# Altium schematic sheet Programming.SchDoc
size A; SheetNumber: 4; SheetTotal: 5
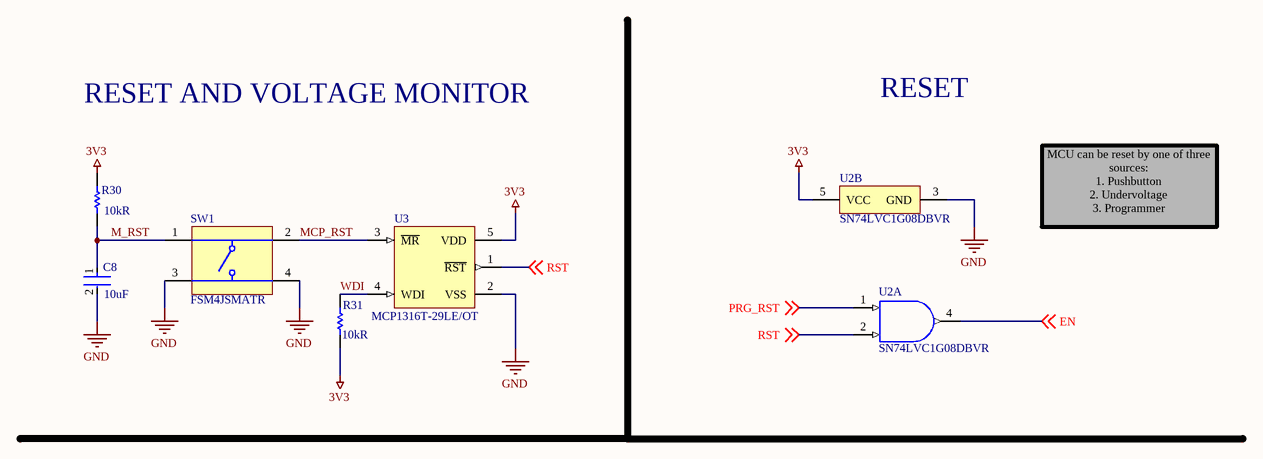
[diagram p0: Programming.SchDoc]

## Parts
C8  value 10uF  [FP-C0805C-DG-MFG]  (hidden comment: C0805C106K8PACTU)
R30  value 10kR  [RESC2013X60X35NL10T20]  (hidden comment: RC0805FR-0710KL)
R31  value 10kR  [RESC2013X60X35NL10T20]  (hidden comment: RC0805FR-0710KL)
SW1  FSM4JSMATR  [TECO-FSM4JSMATR_V]
U2  SN74LVC1G08DBVR  [DBV0005A_M]  (parts A,B of 2)
U3  MCP1316T-29LE/OT  [SOT-23-OT5_M]

## Nets
3V3: R30.2 R31.1 U2.5(VCC) U3.5(VDD)
GND: C8.2 SW1.3 SW1.4 U2.3(GND) U3.2(VSS)
EN: U2.4(Y) ; off-sheet EN
M_RST: C8.1 R30.1 SW1.1
MCP_RST: SW1.2 U3.3(~{MR})
PRG_RST: U2.1(A) ; off-sheet PRG_RST
RST: U2.2(B) U3.1(~{RST}) ; off-sheet RST
WDI: R31.2 U3.4(WDI)

## Notes on the sheet
- RESET AND VOLTAGE MONITOR
- RESET
- MCU can be reset by one of three sources:
  1. Pushbutton
  2. Undervoltage
  3. Programmer

## Library data of the parts
C8 = CMP-2007-03243-2: CAP CER 10UF 10V X5R 0805; Manufacturer: Kemet; 3DS Part Number: 220-00001; Tolerance: 10%; Temperature Coefficient: 15%; Material: Ceramic; Multilayer: Yes; Device Class L2: Capacitors; Device Class L1: Passive Components; ComponentLink2URL: https://content.kemet.com/datasheets/KEM_C1006_X5R_SMD.pdf; Height: 1.4mm; Lead Free: Yes; Manufacturer Part Number: C0805C106K8PACTU; Digikey Description: CAP CER 10UF 10V X5R 0805; Octopart: https://octopart.com/c0805c106k8pactu-kemet-98697; Capacitance: 10uF; Temperature Range Low: -55°C; Temperature: -55°C to +85°C; Automotive: No; Mouser Description: CAP CER 10UF 10V X5R 0805; Ipc Land Pattern Name: CAPC200125X125; Temperature Range High: +85°C; Voltage: 10V; RoHS: TRUE; Device Class L3: Ceramic Capacitors; ComponentLink2Description: Datasheet; Voltage Rating: 10V; Package: C0805C-DG; Temperature Characteristic: X5R; Category: Cap; Supplier: Digikey; Supplier Part Number: 399-C0805C106K8PAC7800DKR-ND; Stock: 5628606; Pricing: 1=0.14, 10=0.098, 50=0.0584, 100=0.0459, 500=0.03388, 1000=0.02805 (USD); Mounting Technology: Surface Mount; Pins: 2; Dielectric Material: Ceramic; Package Shape: Rectangular; Case/Package: 0805; Terminal Finish: Nickel; Min Operating Temperature: -55°C; Max Operating Temperature: 85°C; JESD-609 Code: e3; Capacitor Type: Ceramic; Tolerance  (fill in as +-): 10%; Package Style: SMTMeter; Packaging: Tape and Reel; Tolerance (fill in as +-): 10%; Rated DC Voltage (URdc): 10V; Termination: Wraparound; Temperature Characteristics Code: X5R; Length: 2mm; Width: 1.25mm; Reach SVHC Compliant: Yes; RoHS Compliant: Yes; ComponentLink1URL: https://datasheet.ciiva.com:443/pdfs/VipMasterIC/IC/KEME/KEME-S-A0008991665/KEME-S-A0008991665-1.pdf?src-supplier=IHS+Markit; ComponentLink1Description: https://datasheet.ciiva.com:443/pdfs/VipMasterIC/IC/KEME/KEME-S-A0008991665/KEME-S-A0008991665-1.pdf?src-supplier=IHS+Markit
R30 R31 = CMP-1659-00013-4: Chip Resistor, 10 KOhm, +/- 1%, 0.125 W, -55 to 155 degC, 0805 (2012 Metric), RoHS, Tape and Reel; Manufacturer: Yageo; Voltage Rating: 150 V; Power: 125mW; Rated Temperature: 70°C; Temperature Coefficient: 100ppm/°C; Additional Feature: LASER TRIMMABLE; Working Voltage: 150V; Package Length: 2mm; Package Height: 0.5mm; Package Width: 1.25mm; Mount: Surface Mount; ComponentLink1Description: Manufacturer URL; ComponentLink2URL: http://www.yageo.com/documents/recent/PYu-RC_Group_51_RoHS_L_04.pdf; Pins: 2; Length: 2 mm; Min Operating Temperature: -55 degC; Height: 0.5 mm; Mounting Technology: Surface Mount; RoHSCompliant: true; REACH SVHC: No SVHC; ComponentLink1URL: http://www.yageo.com/; Max Operating Temperature: 155 degC; PackageReference: 0805; DatasheetVersion: Rev. 4, 02/2016; Package Quantity: 5000; Packaging: Tape and Reel; ComponentLink2Description: Datasheet; PackageDescription: 2-Pin Surface Mounted Device, Body 2 x 1.25 mm; Supplier: Digikey; Supplier Part Number: 311-10.0KCRCT-ND; Manufacturer Part Number: RC0805FR-0710KL; RoHS: Yes; Category: Chip SMD Resistors; Stock: 4430741; Pricing: 1=0.1, 10=0.027, 50=0.017, 100=0.0142, 500=0.00976, 1000=0.00844 (USD); Package Shape: Rectangular; Terminal Finish: Nickel; Case/Package: 0805; Tolerance: 1%; JESD-609 Code: e3; Resistor Type: FIXED RESISTOR; Construction: Chip; Package Style: SMTMeter; Technology: METAL GLAZE/THICK FILM; Termination: Wraparound; Reach SVHC Compliant: Yes; RoHS Compliant: Yes; ComponentLink3URL: https://datasheet.ciiva.com:443/pdfs/VipMasterIC/IC/YAGO/YAGO-S-A0008145938/YAGO-S-A0008145938-1.pdf?src-supplier=IHS+Markit; ComponentLink3Description: https://datasheet.ciiva.com:443/pdfs/VipMasterIC/IC/YAGO/YAGO-S-A0008145938/YAGO-S-A0008145938-1.pdf?src-supplier=IHS+Markit; ComponentLink4URL: https://datasheet.ciiva.com/11808/0900766b8106beab-11808151.pdf?src-supplier=Rs; ComponentLink4Description: https://datasheet.ciiva.com/11808/0900766b8106beab-11808151.pdf?src-supplier=Rs; ComponentLink5URL: https://datasheet.ciiva.com/46447/444164-46447563.pdf?src-supplier=Element14; ComponentLink5Description: https://datasheet.ciiva.com/46447/444164-46447563.pdf?src-supplier=Element14; ComponentLink6URL: https://datasheet.ciiva.com/2456/pyu-r-int-thick-7-2456973.pdf?src-supplier=Digikey; ComponentLink6Description: https://datasheet.ciiva.com/2456/pyu-r-int-thick-7-2456973.pdf?src-supplier=Digikey; ComponentLink7URL: https://datasheet.ciiva.com/2456/pyu-r-int-thick-7-2456974.pdf?src-supplier=Digikey; ComponentLink7Description: https://datasheet.ciiva.com/2456/pyu-r-int-thick-7-2456974.pdf?src-supplier=Digikey; ComponentLink8URL: https://datasheet.ciiva.com/2456/pyu-r-int-thick-7-2456972.pdf?src-supplier=Digikey; ComponentLink8Description: https://datasheet.ciiva.com/2456/pyu-r-int-thick-7-2456972.pdf?src-supplier=Digikey; ComponentLink9URL: https://datasheet.ciiva.com/12669/rc0805-12669688.pdf?src-supplier=Mouser; ComponentLink9Description: https://datasheet.ciiva.com/12669/rc0805-12669688.pdf?src-supplier=Mouser; ComponentLink10URL: https://datasheet.ciiva.com/16747/rc0805-16747087.pdf?src-supplier=Future+Electronics; ComponentLink10Description: https://datasheet.ciiva.com/16747/rc0805-16747087.pdf?src-supplier=Future+Electronics
SW1 = CMP-2000-07486-1: Micro Miniature Push Button Switch FSM JSM, 50 mA, -35 to 85 degC, 4-Pin SMD, RoHS, Tape and Reel; Manufacturer: TE Connectivity; Mechanical Life: 100000Cycles; Current Rating: 50mA; Actuator Material: Polyamide; Max Voltage Rating (DC): 12V; Capacitance: 0f; Illumination Type: Illuminated; Voltage Rating (DC): 24V; Case\/Package: SMD/SMT; Operating Force: 160gf; Contact Resistance: 100mOhm; Actuator Length: 0.055inch; Switch Travel: 0.25mm; Throw Configuration: SPST; Circuit Configuration: 1X1; Contact DC Max Rating R Load: .05A@12VDC; Number of Switches: 1; Operating Force-Max: 2.06N; Switch Action: MOMENTARY-TACTILE; Switch Type: Keypad; Body Breadth: 6inch; Body Height: 3.6mm; Body Length or Diameter: 6mm; Termination: GullWing; Contact Plating: Silver; Orientation: Straight; Mounting Technology: SurfaceMount; REACH SVHC: Unknown; Electrical Life: 100000Cycles; Package Reference: FSM4JSMATR; Max Operating Temperature: 85degC; Manufacturer URL: http://www.te.com/; Package Description: 4-Pin Surface Mount Device, Body 6 x 6 mm, Pitch 4.5 mm; Datasheet Version: Rev. V, 02/2015; Packaging: TapeandReel; Min Operating Temperature: -35degC; Mount: SurfaceMount; Contact Current Rating: 50mA; Contact Material: CopperAlloy; Package Quantity: 1200; Datasheet URL: http://www.te.com/commerce/DocumentDelivery/DDEController?Action=showdoc&DocId=Customer+Drawing%7F2-1437565-7%7FV%7Fpdf%7FEnglish%7FENG_CD_2-1437565-7_V.pdf%7F4-1437565-2; RoHSCompliant: true; Supplier: Digikey; Supplier Part Number: 450-1759-1-ND; Manufacturer Part Number: FSM4JSMATR; RoHS: Yes; Category: Pushbutton Switches; Stock: 69097; Pricing: 1=0.36, 10=0.351, 25=0.33, 100=0.2866, 250=0.26, 500=0.24188 (USD); Terminal Finish: Silver; JESD-609 Code: e4; Contact Current(DC)-Max: 50mA; Contact Voltage(DC)-Max: 12V; Switch Function: SPST; Reach SVHC Compliant: Yes; RoHS Compliant: Yes; ComponentLink1URL: https://datasheet.ciiva.com:443/pdfs/VipMasterIC/IC/TYEL/TYEL-S-A0008743874/TYEL-S-A0008712894-1.pdf?src-supplier=IHS+Markit; ComponentLink1Description: https://datasheet.ciiva.com:443/pdfs/VipMasterIC/IC/TYEL/TYEL-S-A0008743874/TYEL-S-A0008712894-1.pdf?src-supplier=IHS+Markit; ComponentLink2URL: https://datasheet.ciiva.com/5801/eng-cd-2-1437565-7-u2-5801346.pdf?src-supplier=Farnell; ComponentLink2Description: https://datasheet.ciiva.com/5801/eng-cd-2-1437565-7-u2-5801346.pdf?src-supplier=Farnell; ComponentLink3URL: https://datasheet.ciiva.com/23765/1486934-23765878.pdf?src-supplier=Newark; ComponentLink3Description: https://datasheet.ciiva.com/23765/1486934-23765878.pdf?src-supplier=Newark; ComponentLink4URL: https://datasheet.ciiva.com/1530/1683375-1530944.pdf?src-supplier=Element14; ComponentLink4Description: https://datasheet.ciiva.com/1530/1683375-1530944.pdf?src-supplier=Element14; ComponentLink5URL: https://datasheet.ciiva.com/16320/eng-cs-1308111-1-switches-core-program-catalog-0308-16320065.pdf?src-supplier=Future+Electronics; ComponentLink5Description: https://datasheet.ciiva.com/16320/eng-cs-1308111-1-switches-core-program-catalog-0308-16320065.pdf?src-supplier=Future+Electronics; ComponentLink6URL: https://datasheet.ciiva.com/7638/921681-7638037.pdf?src-supplier=Element14; ComponentLink6Description: https://datasheet.ciiva.com/7638/921681-7638037.pdf?src-supplier=Element14
U2 = CMP-0859-00053-3: Single 2-Input Positive-AND Gate, DBV0005A, LARGE T&R; Manufacturer: Texas Instruments; Logic: True; ICC @ Nom Voltage(Max)(mA): 0.01; VCC(Min)(V): 1.65; Bits(#): 1; Rating: Catalog; Schmitt Trigger: No; Voltage(Nom)(V): 1.8,2.5,3.3,5; Output Drive (IOL/IOH)(Max)(mA): 32/-32; Gate Type: AND; tpd @ Nom Voltage(Max)(ns): 4.5,6,4,5; VCC(Max)(V): 5.5; Output Type: CMOS; F @ Nom Voltage(Max)(Mhz): 150; Input Type: CMOS/TTL; Technology Family: LVC; Sub-Family: AND Gate; PackageReference: DBV0005A; Generic Part Number: SN74LVC1G08; Operating Temperature Range(C): -40 to 125,-40 to 85; 3-State Output: No; DatasheetVersion: SCES217Y
U3 = CMP-0138-00207-1: Voltage Supervisor, 5-Pin SOT-23, Extended Temperature, Tape and Reel; PackageReference: SOT-23-OT5; Code_IPC: SOT23-5; DatasheetVersion: revB, Oct-2007; PackageDescription: 5-Lead Plastic Small Outline Transistor (OT) [SOT-23]; PackageVersion: revBB, Aug-2009